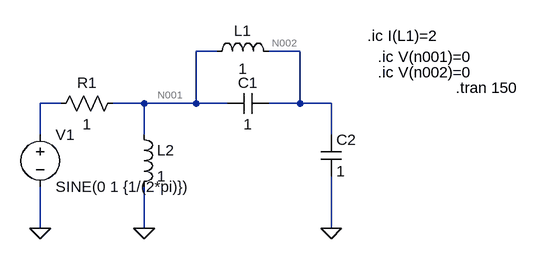
[diagram p0: schematic ejemplo2.asc]
ejemplo2.asc, the LTspice schematic file:
Version 4
SHEET 1 880 680
WIRE 32 112 0 112
WIRE 160 112 112 112
WIRE -208 192 -240 192
WIRE -80 192 -128 192
WIRE 0 192 0 112
WIRE 0 192 -80 192
WIRE 48 192 0 192
WIRE 160 192 160 112
WIRE 160 192 112 192
WIRE 208 192 160 192
WIRE -240 240 -240 192
WIRE -80 240 -80 192
WIRE 208 240 208 192
WIRE -240 384 -240 320
WIRE -80 384 -80 320
WIRE 208 384 208 304
FLAG 208 384 0
FLAG -80 384 0
FLAG -240 384 0
SYMBOL ind 16 128 R270
WINDOW 0 32 56 VTop 2
WINDOW 3 5 56 VBottom 2
SYMATTR InstName L1
SYMATTR Value 1
SYMATTR SpiceLine Rser=0
SYMBOL cap 112 176 R90
WINDOW 0 0 32 VBottom 2
WINDOW 3 32 32 VTop 2
SYMATTR InstName C1
SYMATTR Value 1
SYMBOL cap 192 240 R0
SYMATTR InstName C2
SYMATTR Value 1
SYMBOL ind -96 224 R0
SYMATTR InstName L2
SYMATTR Value 1
SYMATTR SpiceLine Rser=0
SYMBOL voltage -240 224 R0
WINDOW 123 0 0 Left 0
WINDOW 39 0 0 Left 0
SYMATTR InstName V1
SYMATTR Value SINE(0 1 {1/(2*pi)})
SYMBOL res -112 176 R90
WINDOW 0 0 56 VBottom 2
WINDOW 3 32 56 VTop 2
SYMATTR InstName R1
SYMATTR Value 1
TEXT 264 88 Left 2 !.ic I(L1)=2
TEXT 400 168 Left 2 !.tran 150
TEXT 280 120 Left 2 !.ic V(n001)=0
TEXT 280 144 Left 2 !.ic V(n002)=0

The netlist it stands for:
* ejemplo2.asc
L1 N001 N002 1 Rser=0
C1 N002 N001 1
C2 N002 0 1
L2 N001 0 1 Rser=0
V1 N003 0 SINE(0 1 {1/(2*pi)})
R1 N001 N003 1
.ic I(L1)=2
.tran 150
.ic V(n001)=0
.ic V(n002)=0
.backanno
.end